# Altium schematic sheet Connectors - Digital.SchDoc: Connectors - Digital
size B; DrawnBy: Jasper Yun; SheetNumber: 3; SheetTotal: 13; Competition: SAC 2021; Subteam: Avionics; University: McGill University; Location: Montreal, Quebec; Project: Avionics Project Name; MRT: McGill Rocket Team
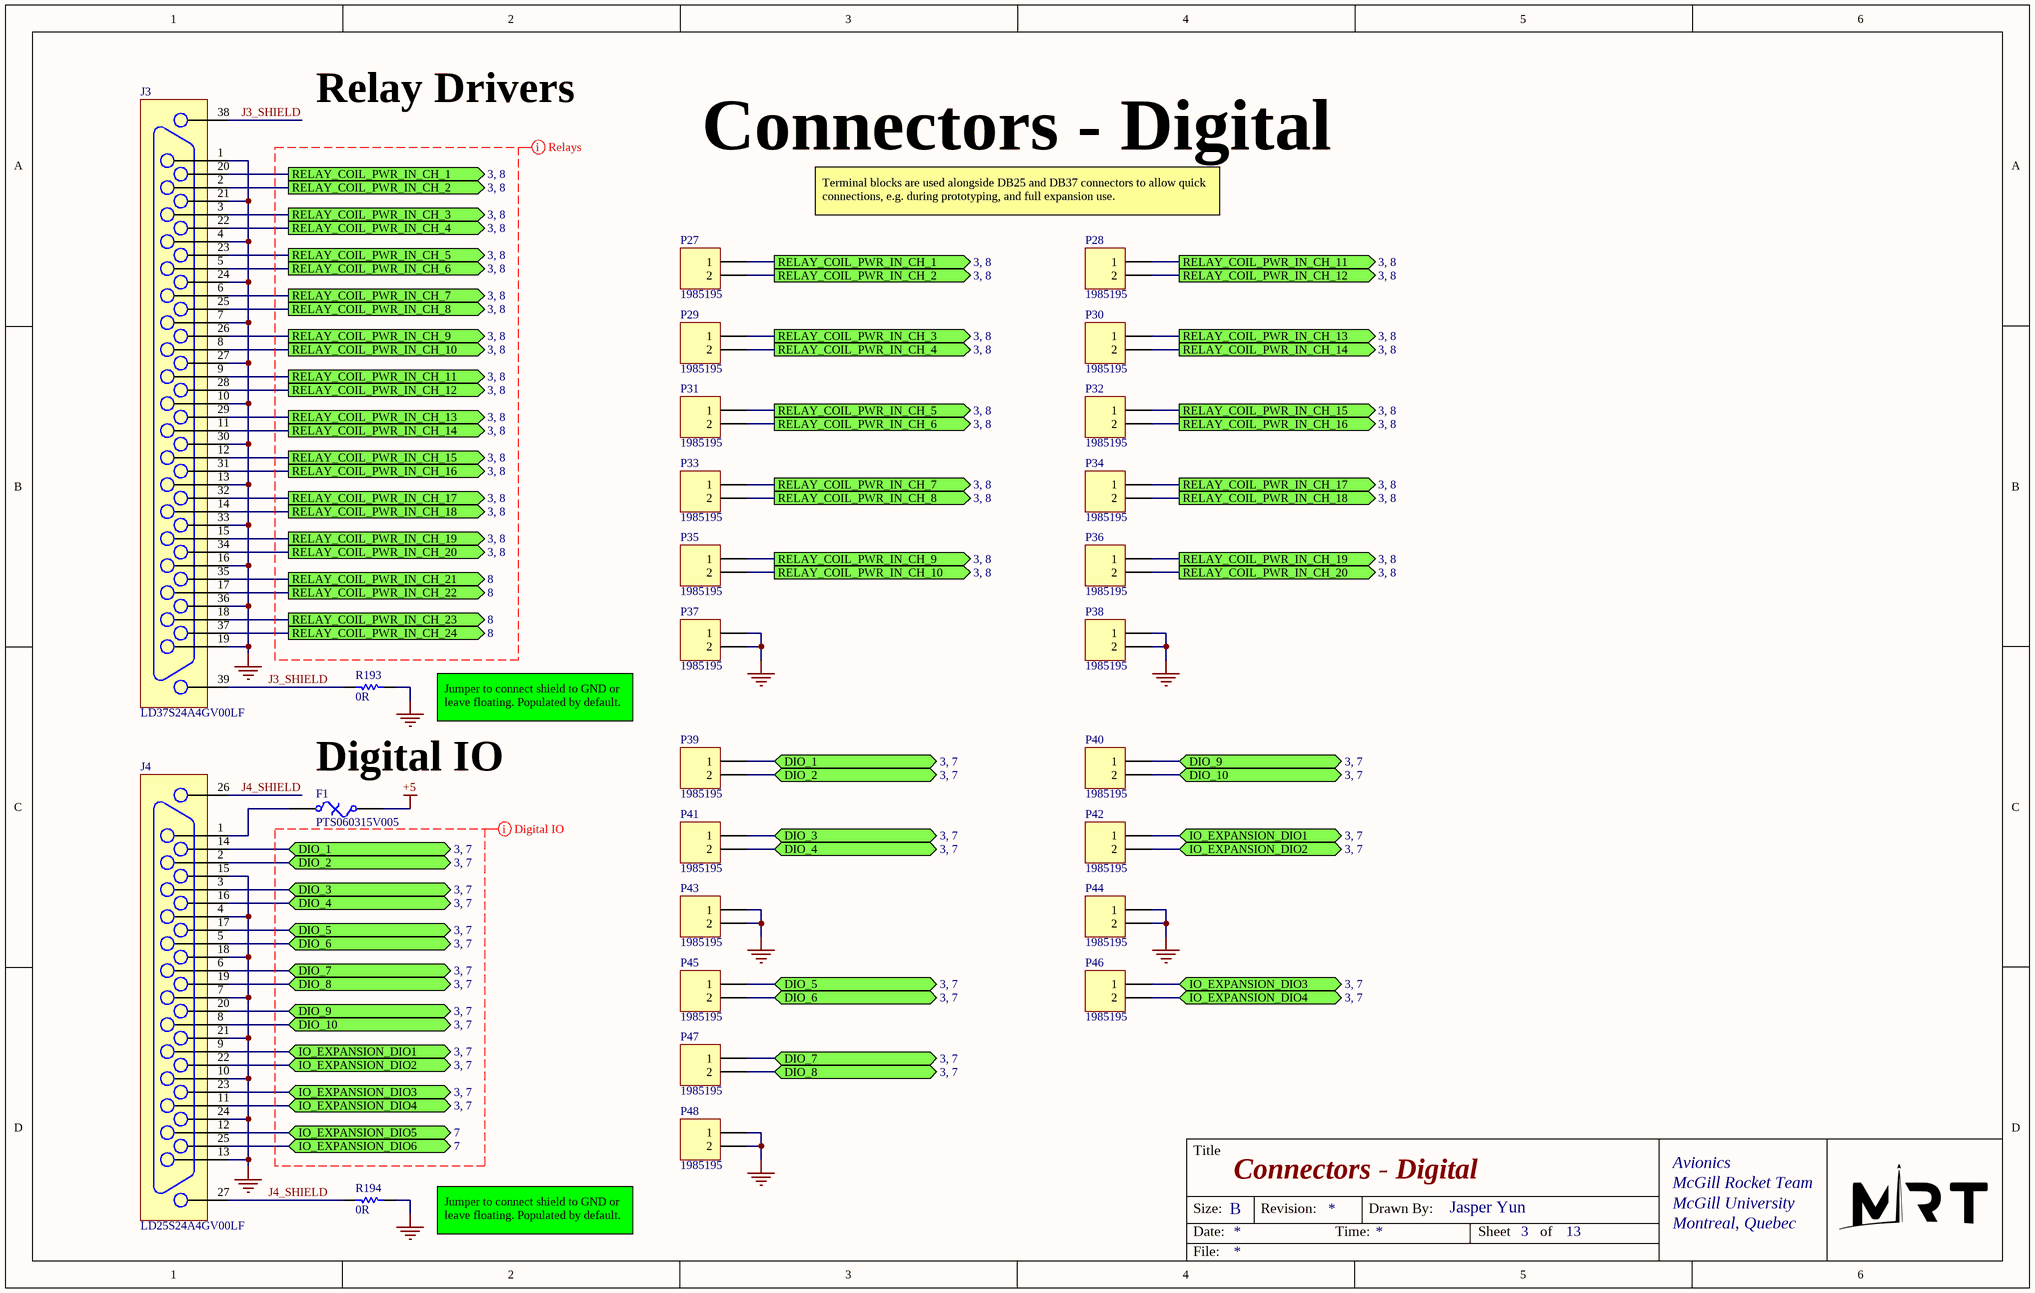
[diagram p0: Connectors - Digital.SchDoc]

## Parts
F1  PTS060315V005  [Fuse Thermal 0603 PTS060315V005]
J3  LD37S24A4GV00LF  [Connector DB37 Vertical LD37S24A4GV00LF]
J4  LD25S24A4GV00LF  [Connector DB25 Vertical LD25S24A4GV00LF]
P27  1985195  [Terminal Block 1985195 2-pos 3.5mm pitch]
P28  1985195  [Terminal Block 1985195 2-pos 3.5mm pitch]
P29  1985195  [Terminal Block 1985195 2-pos 3.5mm pitch]
P30  1985195  [Terminal Block 1985195 2-pos 3.5mm pitch]
P31  1985195  [Terminal Block 1985195 2-pos 3.5mm pitch]
P32  1985195  [Terminal Block 1985195 2-pos 3.5mm pitch]
P33  1985195  [Terminal Block 1985195 2-pos 3.5mm pitch]
P34  1985195  [Terminal Block 1985195 2-pos 3.5mm pitch]
P35  1985195  [Terminal Block 1985195 2-pos 3.5mm pitch]
P36  1985195  [Terminal Block 1985195 2-pos 3.5mm pitch]
P37  1985195  [Terminal Block 1985195 2-pos 3.5mm pitch]
P38  1985195  [Terminal Block 1985195 2-pos 3.5mm pitch]
P39  1985195  [Terminal Block 1985195 2-pos 3.5mm pitch]
P40  1985195  [Terminal Block 1985195 2-pos 3.5mm pitch]
P41  1985195  [Terminal Block 1985195 2-pos 3.5mm pitch]
P42  1985195  [Terminal Block 1985195 2-pos 3.5mm pitch]
P43  1985195  [Terminal Block 1985195 2-pos 3.5mm pitch]
P44  1985195  [Terminal Block 1985195 2-pos 3.5mm pitch]
P45  1985195  [Terminal Block 1985195 2-pos 3.5mm pitch]
P46  1985195  [Terminal Block 1985195 2-pos 3.5mm pitch]
P47  1985195  [Terminal Block 1985195 2-pos 3.5mm pitch]
P48  1985195  [Terminal Block 1985195 2-pos 3.5mm pitch]
R193  0R  [0402 RES]
R194  0R  [0402 RES]

## Ports
DIO_1 (bidir, see 3, 7), DIO_2 (bidir, see 3, 7), DIO_3 (bidir, see 3, 7), DIO_4 (bidir, see 3, 7), DIO_5 (bidir, see 3, 7), DIO_6 (bidir, see 3, 7), DIO_7 (bidir, see 3, 7), DIO_8 (bidir, see 3, 7), DIO_9 (bidir, see 3, 7), DIO_10 (bidir, see 3, 7), IO_EXPANSION_DIO1 (bidir, see 3, 7), IO_EXPANSION_DIO2 (bidir, see 3, 7), IO_EXPANSION_DIO3 (bidir, see 3, 7), IO_EXPANSION_DIO4 (bidir, see 3, 7), IO_EXPANSION_DIO5 (bidir, see 7), IO_EXPANSION_DIO6 (bidir, see 7), RELAY_COIL_PWR_IN_CH_1 (out, see 3, 8), RELAY_COIL_PWR_IN_CH_2 (out, see 3, 8), RELAY_COIL_PWR_IN_CH_3 (out, see 3, 8), RELAY_COIL_PWR_IN_CH_4 (out, see 3, 8), RELAY_COIL_PWR_IN_CH_5 (out, see 3, 8), RELAY_COIL_PWR_IN_CH_6 (out, see 3, 8), RELAY_COIL_PWR_IN_CH_7 (out, see 3, 8), RELAY_COIL_PWR_IN_CH_8 (out, see 3, 8), RELAY_COIL_PWR_IN_CH_9 (out, see 3, 8), RELAY_COIL_PWR_IN_CH_10 (out, see 3, 8), RELAY_COIL_PWR_IN_CH_11 (out, see 3, 8), RELAY_COIL_PWR_IN_CH_12 (out, see 3, 8), RELAY_COIL_PWR_IN_CH_13 (out, see 3, 8), RELAY_COIL_PWR_IN_CH_14 (out, see 3, 8), RELAY_COIL_PWR_IN_CH_15 (out, see 3, 8), RELAY_COIL_PWR_IN_CH_16 (out, see 3, 8), RELAY_COIL_PWR_IN_CH_17 (out, see 3, 8), RELAY_COIL_PWR_IN_CH_18 (out, see 3, 8), RELAY_COIL_PWR_IN_CH_19 (out, see 3, 8), RELAY_COIL_PWR_IN_CH_20 (out, see 3, 8), RELAY_COIL_PWR_IN_CH_21 (out, see 8), RELAY_COIL_PWR_IN_CH_22 (out, see 8), RELAY_COIL_PWR_IN_CH_23 (out, see 8), RELAY_COIL_PWR_IN_CH_24 (out, see 8)

## Nets
+5: F1.2
GND: J3.1 J3.4 J3.7 J3.10 J3.13 J3.16 J3.19 J3.21 J3.24 J3.27 J3.30 J3.33 J3.36 J4.4 J4.7 J4.10 J4.13 J4.15 J4.18 J4.21 J4.24 P37.1 P37.2 P38.1 P38.2 P43.1 P43.2 P44.1 P44.2 P48.1 P48.2 R193.2 R194.2
DIO_1: J4.14 P39.1 ; port DIO_1
DIO_2: J4.2 P39.2 ; port DIO_2
DIO_3: J4.3 P41.1 ; port DIO_3
DIO_4: J4.16 P41.2 ; port DIO_4
DIO_5: J4.17 P45.1 ; port DIO_5
DIO_6: J4.5 P45.2 ; port DIO_6
DIO_7: J4.6 P47.1 ; port DIO_7
DIO_8: J4.19 P47.2 ; port DIO_8
DIO_9: J4.20 P40.1 ; port DIO_9
DIO_10: J4.8 P40.2 ; port DIO_10
IO_EXPANSION_DIO1: J4.9 P42.1 ; port IO_EXPANSION_DIO1
IO_EXPANSION_DIO2: J4.22 P42.2 ; port IO_EXPANSION_DIO2
IO_EXPANSION_DIO3: J4.23 P46.1 ; port IO_EXPANSION_DIO3
IO_EXPANSION_DIO4: J4.11 P46.2 ; port IO_EXPANSION_DIO4
IO_EXPANSION_DIO5: J4.12 ; port IO_EXPANSION_DIO5
IO_EXPANSION_DIO6: J4.25 ; port IO_EXPANSION_DIO6
J3_SHIELD: J3.38 J3.39 R193.1
J4_SHIELD: J4.26 J4.27 R194.1
RELAY_COIL_PWR_IN_CH_1: J3.20 P27.1 ; port RELAY_COIL_PWR_IN_CH_1
RELAY_COIL_PWR_IN_CH_2: J3.2 P27.2 ; port RELAY_COIL_PWR_IN_CH_2
RELAY_COIL_PWR_IN_CH_3: J3.3 P29.1 ; port RELAY_COIL_PWR_IN_CH_3
RELAY_COIL_PWR_IN_CH_4: J3.22 P29.2 ; port RELAY_COIL_PWR_IN_CH_4
RELAY_COIL_PWR_IN_CH_5: J3.23 P31.1 ; port RELAY_COIL_PWR_IN_CH_5
RELAY_COIL_PWR_IN_CH_6: J3.5 P31.2 ; port RELAY_COIL_PWR_IN_CH_6
RELAY_COIL_PWR_IN_CH_7: J3.6 P33.1 ; port RELAY_COIL_PWR_IN_CH_7
RELAY_COIL_PWR_IN_CH_8: J3.25 P33.2 ; port RELAY_COIL_PWR_IN_CH_8
RELAY_COIL_PWR_IN_CH_9: J3.26 P35.1 ; port RELAY_COIL_PWR_IN_CH_9
RELAY_COIL_PWR_IN_CH_10: J3.8 P35.2 ; port RELAY_COIL_PWR_IN_CH_10
RELAY_COIL_PWR_IN_CH_11: J3.9 P28.1 ; port RELAY_COIL_PWR_IN_CH_11
RELAY_COIL_PWR_IN_CH_12: J3.28 P28.2 ; port RELAY_COIL_PWR_IN_CH_12
RELAY_COIL_PWR_IN_CH_13: J3.29 P30.1 ; port RELAY_COIL_PWR_IN_CH_13
RELAY_COIL_PWR_IN_CH_14: J3.11 P30.2 ; port RELAY_COIL_PWR_IN_CH_14
RELAY_COIL_PWR_IN_CH_15: J3.12 P32.1 ; port RELAY_COIL_PWR_IN_CH_15
RELAY_COIL_PWR_IN_CH_16: J3.31 P32.2 ; port RELAY_COIL_PWR_IN_CH_16
RELAY_COIL_PWR_IN_CH_17: J3.32 P34.1 ; port RELAY_COIL_PWR_IN_CH_17
RELAY_COIL_PWR_IN_CH_18: J3.14 P34.2 ; port RELAY_COIL_PWR_IN_CH_18
RELAY_COIL_PWR_IN_CH_19: J3.15 P36.1 ; port RELAY_COIL_PWR_IN_CH_19
RELAY_COIL_PWR_IN_CH_20: J3.34 P36.2 ; port RELAY_COIL_PWR_IN_CH_20
RELAY_COIL_PWR_IN_CH_21: J3.35 ; port RELAY_COIL_PWR_IN_CH_21
RELAY_COIL_PWR_IN_CH_22: J3.17 ; port RELAY_COIL_PWR_IN_CH_22
RELAY_COIL_PWR_IN_CH_23: J3.18 ; port RELAY_COIL_PWR_IN_CH_23
RELAY_COIL_PWR_IN_CH_24: J3.37 ; port RELAY_COIL_PWR_IN_CH_24
NetF1_1: F1.1 J4.1

## Layout directives
net class Digital IO: (no net found under the mark)
net class Relays: (no net found under the mark)

## Notes on the sheet
- Relay Drivers
- (near P28) Terminal blocks are used alongside DB25 and DB37 connectors to allow quick connections, e.g. during prototyping, and full expansion use.
- (near F1) Digital IO
- Jumper to connect shield to GND or leave floating. Populated by default.
- Title
- Size:
- Date:
- B
- Revision:
- Time:
- Drawn By:
- Sheet
- of
- File:

## Library data of the parts
F1 = Fuse Thermal: Thermal Fuse; Published: 24-Mar-1999; LatestRevisionDate: 17-Jul-2002; LatestRevisionNote: Re-released for DXP Platform.; PackageReference: PIN-W2/E2.8; Publisher: Altium Limited; PackageDescription: Thru-Hole; 2 Leads
J3 = Connector DB37 (LD37S24A4GV00LF): DB37 LD37S24A4GV00LF (Amphenol ICC)
J4 = Connector DB25 (LD25S24A4GV00LF): DB25 LD25S24A4GV00LF (Amphenol ICC)
P27-P48 = Header 2: Header, 2-Pin; LatestRevisionDate: 17-Jul-2002; LatestRevisionNote: Re-released for DXP Platform.; Publisher: Altium Limited
R193 R194 = Res1: Resistor; Value: 1%; Published: 8-Jun-2000; LatestRevisionDate: 17-Jul-2002; LatestRevisionNote: Re-released for DXP Platform.; PackageReference: AXIAL-0.3; Publisher: Altium Limited; PackageDescription: Axial Device, Thru-Hole; 2 Leads; 0.3 in Pin Spacing